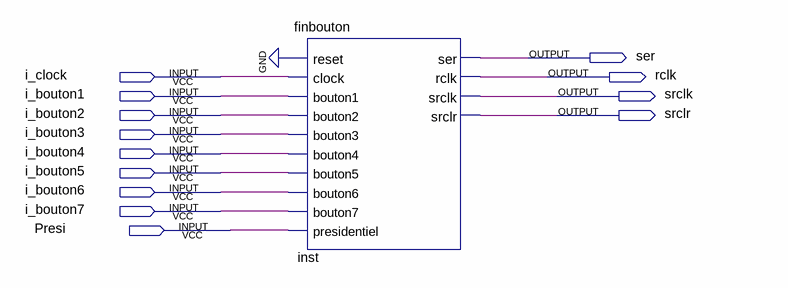
[diagram p0: schematic sheet]
// Quartus schematic principal.bdf as structural Verilog: 1 symbols, 13 pins
module principal (
  input  i_clock,
  input  i_bouton1,
  input  i_bouton2,
  input  i_bouton3,
  input  i_bouton4,
  input  i_bouton5,
  input  i_bouton6,
  input  i_bouton7,
  input  Presi,
  output ser,
  output rclk,
  output srclk,
  output srclr
);

  finbouton inst (
    .reset(1'b0), .clock(i_clock), .bouton1(i_bouton1), .bouton2(i_bouton2), .bouton3(i_bouton3),
    .bouton4(i_bouton4), .bouton5(i_bouton5), .bouton6(i_bouton6), .bouton7(i_bouton7), .presidentiel(Presi),
    .ser(ser), .rclk(rclk), .srclk(srclk), .srclr(srclr));
endmodule
